# EAGLE design meca_2014 (EAGLE 6.5.0)
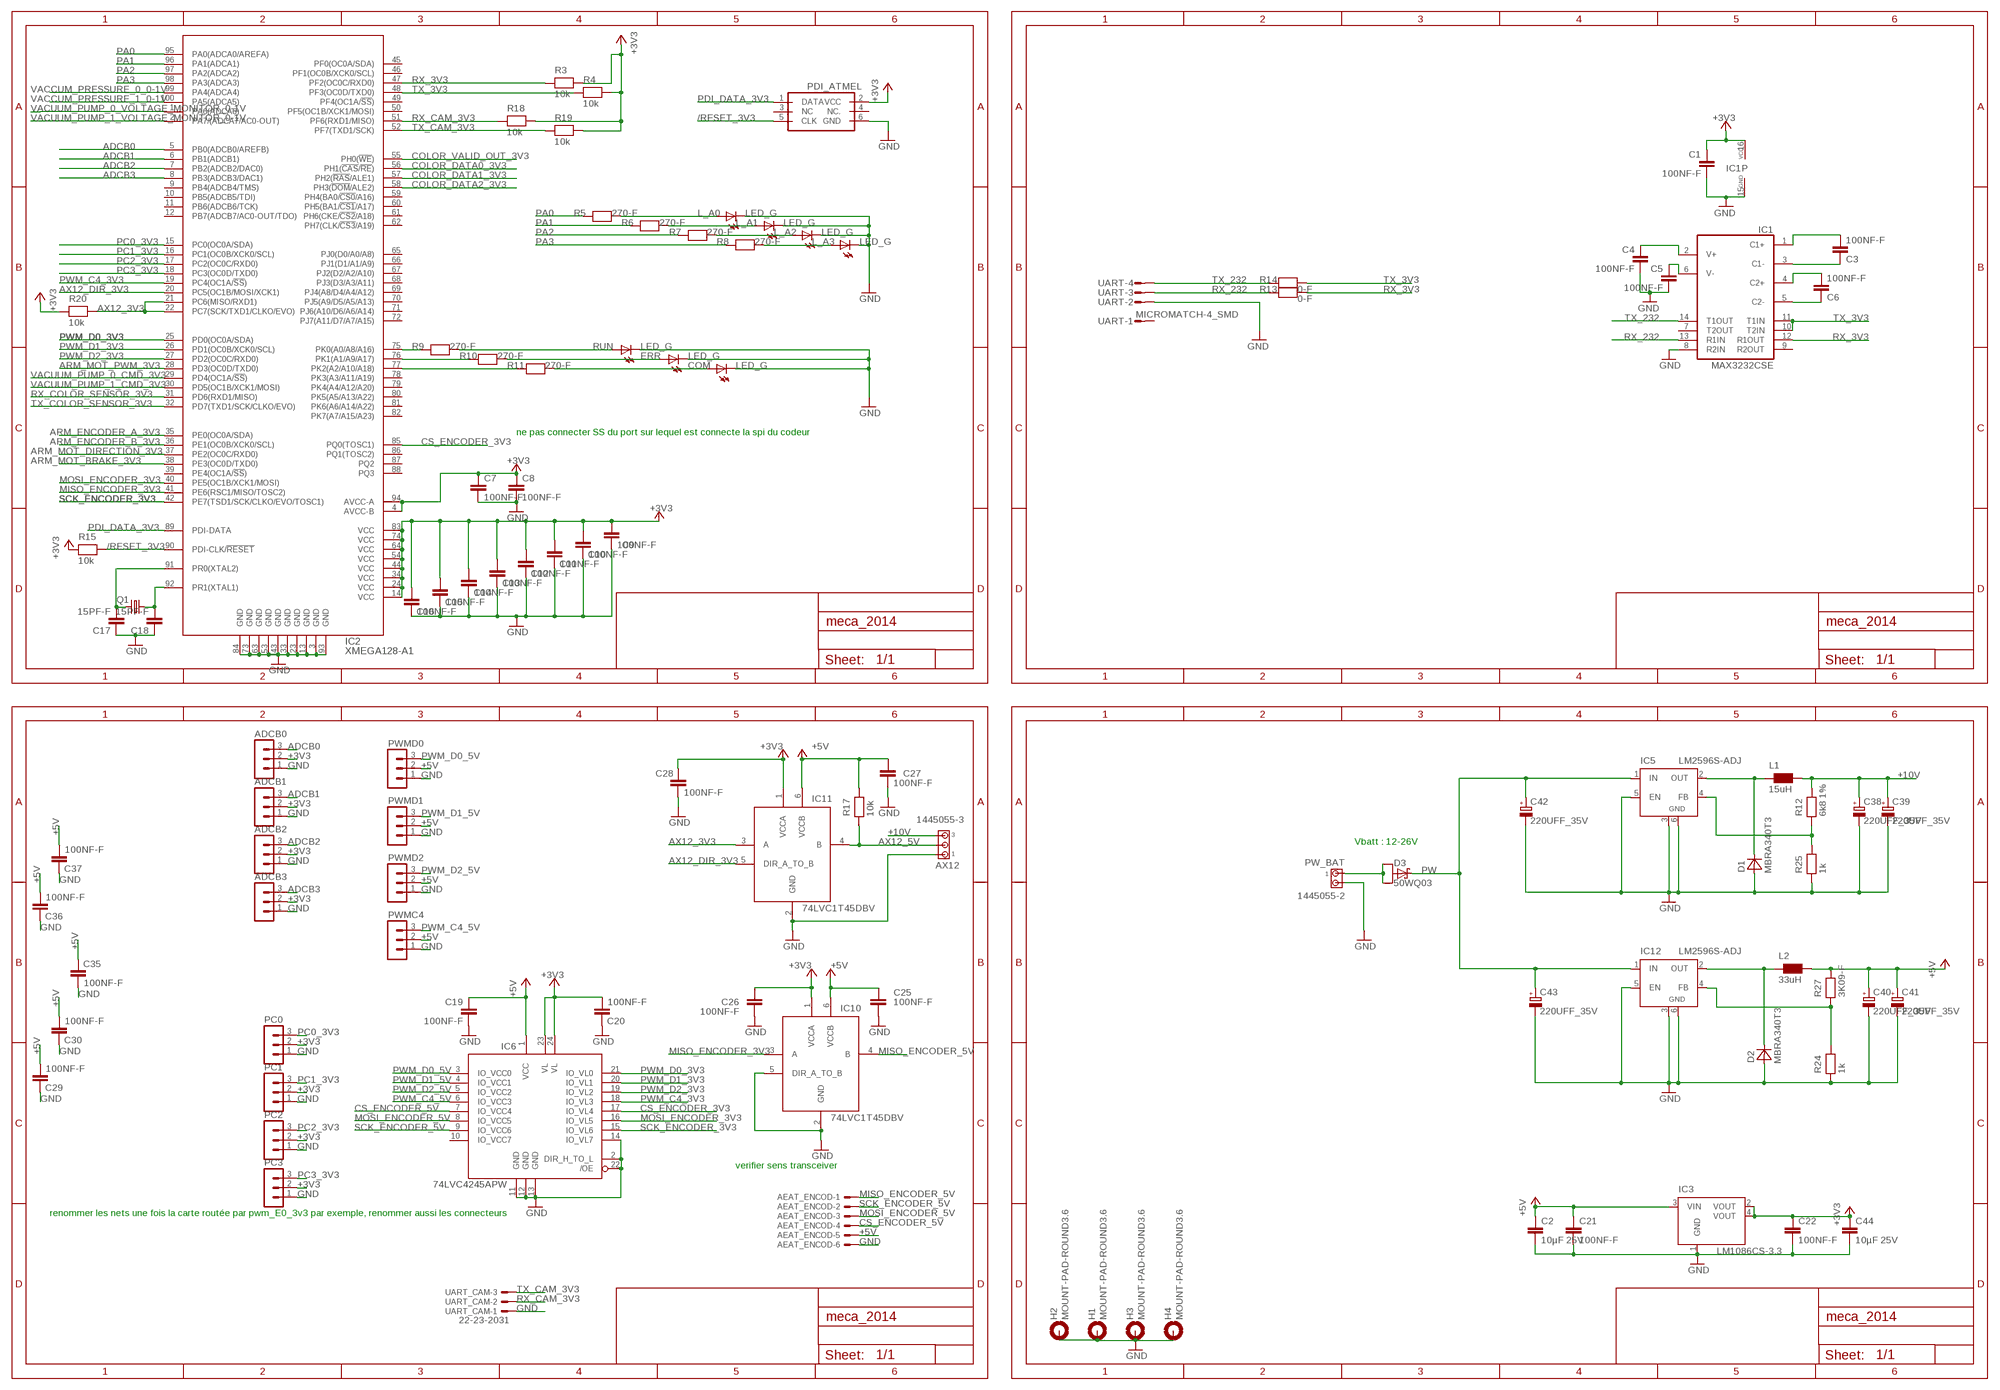
[diagram p0: schematic, sheet 1, part 1 of 2]
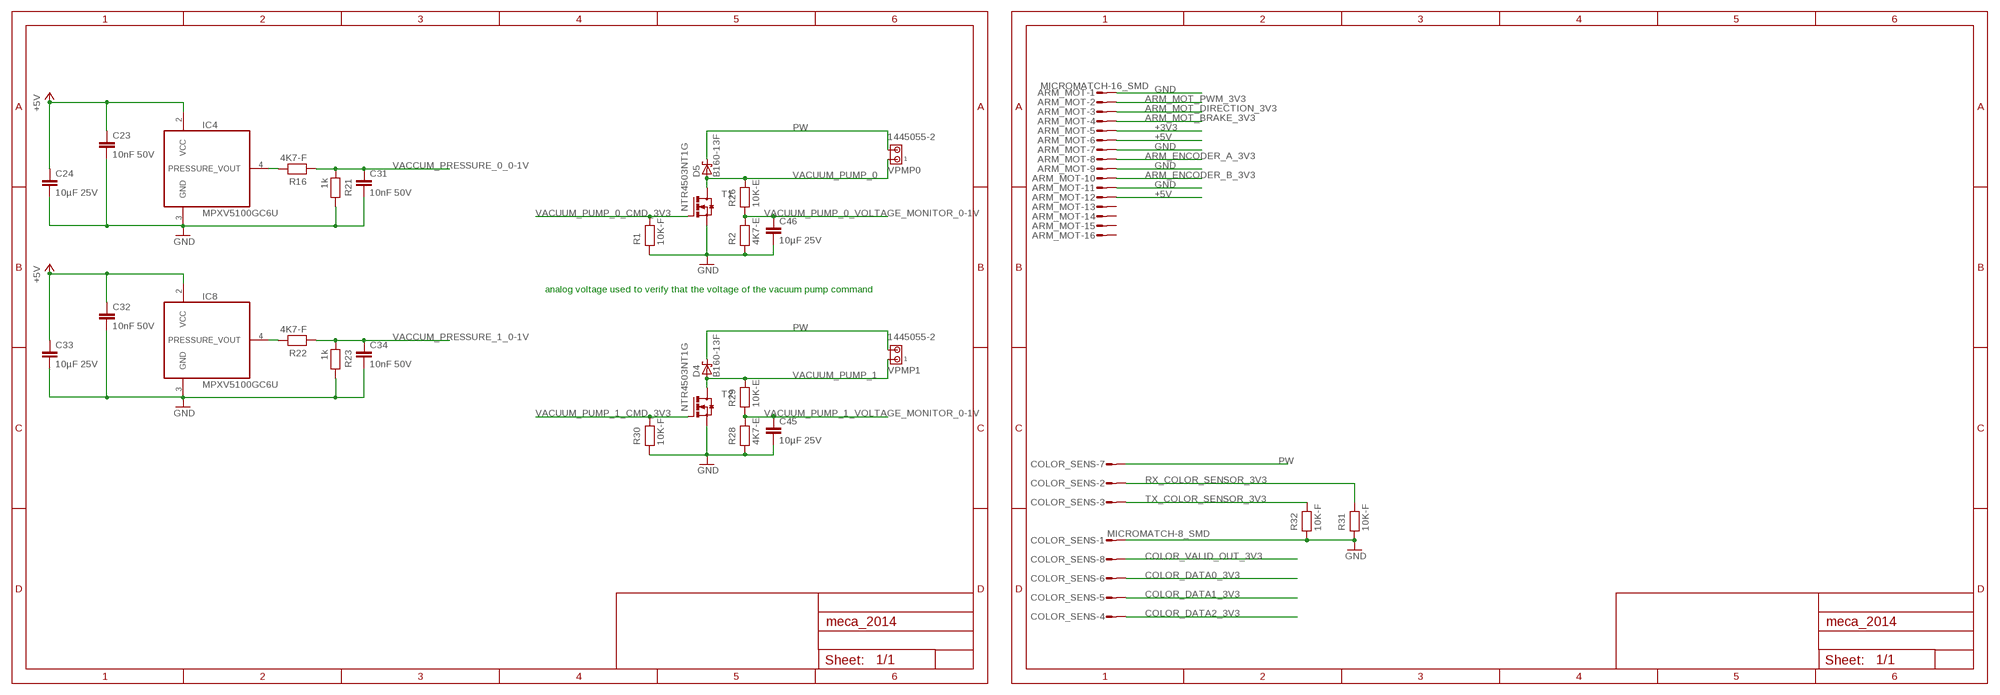
[diagram p1: schematic, sheet 1, part 2 of 2]

## Parts
ADCB0  MA03-1  [MA03-1]
ADCB1  MA03-1  [MA03-1]
ADCB2  MA03-1  [MA03-1]
ADCB3  MA03-1  [MA03-1]
AEAT_ENCOD  22-23-2061  [22-23-2061]
ARM_MOT  MICROMATCH-16_SMD  [MICROMATCH-16_SMD]
AX12  1445055-3  [1445055-3]
C1  100NF-F  [C0603]
C2  10µF 25V  10UF-C_25V  [C1210]
C3  100NF-F  [C0603]
C4  100NF-F  [C0603]
C5  100NF-F  [C0603]
C6  100NF-F  [C0603]
C7  100NF-F  [C0603]
C8  100NF-F  [C0603]
C9  100NF-F  [C0603]
C10  100NF-F  [C0603]
C11  100NF-F  [C0603]
C12  100NF-F  [C0603]
C13  100NF-F  [C0603]
C14  100NF-F  [C0603]
C15  100NF-F  [C0603]
C16  100NF-F  [C0603]
C17  15PF-F  [C0603]
C18  15PF-F  [C0603]
C19  100NF-F  [C0603]
C20  100NF-F  [C0603]
C21  100NF-F  [C0603]
C22  100NF-F  [C0603]
C23  10nF 50V  10NF-F  [C0603]
C24  10µF 25V  10UF-C_25V  [C1210]
C25  100NF-F  [C0603]
C26  100NF-F  [C0603]
C27  100NF-F  [C0603]
C28  100NF-F  [C0603]
C29  100NF-F  [C0603]
C30  100NF-F  [C0603]
C31  10nF 50V  10NF-F  [C0603]
C32  10nF 50V  10NF-F  [C0603]
C33  10µF 25V  10UF-C_25V  [C1210]
C34  10nF 50V  10NF-F  [C0603]
C35  100NF-F  [C0603]
C36  100NF-F  [C0603]
C37  100NF-F  [C0603]
C38  220UFF_35V  [PANASONIC_F]
C39  220UFF_35V  [PANASONIC_F]
C40  220UFF_35V  [PANASONIC_F]
C41  220UFF_35V  [PANASONIC_F]
C42  220UFF_35V  [PANASONIC_F]
C43  220UFF_35V  [PANASONIC_F]
C44  10µF 25V  10UF-C_25V  [C1210]
C45  10µF 25V  10UF-C_25V  [C1210]
C46  10µF 25V  10UF-C_25V  [C1210]
COLOR_SENS  MICROMATCH-8_SMD  [MICROMATCH-8_SMD]
COM  LED_G  [CHIP-LED0805]
D1  MBRA340T3  [SMA]
D2  MBRA340T3  [SMA]
D3  50WQ03  [TO252]
D4  B160-13F  [SMA]
D5  B160-13F  [SMA]
ERR  LED_G  [CHIP-LED0805]
H1  MOUNT-PAD-ROUND3.6  [3,6-PAD]
H2  MOUNT-PAD-ROUND3.6  [3,6-PAD]
H3  MOUNT-PAD-ROUND3.6  [3,6-PAD]
H4  MOUNT-PAD-ROUND3.6  [3,6-PAD]
IC1  MAX3232CSE  [SO16]
IC2  XMEGA128-A1  XMEGA-A1TQFP  [TQFP100]
IC3  LM1086CS-3.3  [TO263]
IC4  MPXV5100GC6U  [482A]
IC5  LM2596S-ADJ  [TO263-5]
IC6  74LVC4245APW  [TSSOP24]
IC8  MPXV5100GC6U  [482A]
IC10  74LVC1T45DBV  [SOT23-6]
IC11  74LVC1T45DBV  [SOT23-6]
IC12  LM2596S-ADJ  [TO263-5]
L1  15uH  SRR1280-150  [SRR1280]
L2  33uH  33µH-3.3A  [SRR1280]
L_A0  LED_G  [CHIP-LED0805]
L_A1  LED_G  [CHIP-LED0805]
L_A2  LED_G  [CHIP-LED0805]
L_A3  LED_G  [CHIP-LED0805]
PC0  MA03-1  [MA03-1]
PC1  MA03-1  [MA03-1]
PC2  MA03-1  [MA03-1]
PC3  MA03-1  [MA03-1]
PDI_ATMEL  PDI_ATMELL  [ML6L]
PW_BAT  1445055-2  [1445055-2]
PWMC4  MA03-1  [MA03-1]
PWMD0  MA03-1  [MA03-1]
PWMD1  MA03-1  [MA03-1]
PWMD2  MA03-1  [MA03-1]
Q1  CRYSTAL_16MHZ_HC49UP  [HC49UP]
R1  10K-F  [R0603]
R2  4K7-E  [R0805]
R3  10k  10K-F  [R0603]
R4  10k  10K-F  [R0603]
R5  270-F  [R0603]
R6  270-F  [R0603]
R7  270-F  [R0603]
R8  270-F  [R0603]
R9  270-F  [R0603]
R10  270-F  [R0603]
R11  270-F  [R0603]
R12  6k8 1%  6K8-F  [R0603]
R13  0-F  [R0603]
R14  0-F  [R0603]
R15  10k  10K-F  [R0603]
R16  4K7-F  [R0603]
R17  10k  10K-F  [R0603]
R18  10k  10K-F  [R0603]
R19  10k  10K-F  [R0603]
R20  10k  10K-F  [R0603]
R21  1k  1K-F  [R0603]
R22  4K7-F  [R0603]
R23  1k  1K-F  [R0603]
R24  1k  1K-F  [R0603]
R25  1k  1K-F  [R0603]
R26  10K-E  [R0805]
R27  3K09-F  [R0603]
R28  4K7-E  [R0805]
R29  10K-E  [R0805]
R30  10K-F  [R0603]
R31  10K-F  [R0603]
R32  10K-F  [R0603]
RUN  LED_G  [CHIP-LED0805]
T1  NTR4503NT1G  [SOT23]
T2  NTR4503NT1G  [SOT23]
UART  MICROMATCH-4_SMD  [MICROMATCH-4_SMD]
UART_CAM  22-23-2031  [22-23-2031]
VPMP0  1445055-2  [1445055-2]
VPMP1  1445055-2  [1445055-2]

## Nets
+3V3: ADCB0.2 ADCB1.2 ADCB2.2 ADCB3.2 ARM_MOT.5 C1.1 C7.1 C8.1 C9.1 C10.1 C11.1 C12.1 C13.1 C14.1 C15.1 C16.1 C20.1 C22.1 C26.1 C28.1 C44.1 IC1.16(VCC) IC2.4(AVCC-B) IC2.14(VCC) IC2.24(VCC) IC2.34(VCC) IC2.44(VCC) IC2.54(VCC) IC2.64(VCC) IC2.74(VCC) IC2.83(VCC) IC2.94(AVCC-A) IC3.2(VOUT) IC3.4(VOUT) IC6.23(VL) IC6.24(VL) IC10.1(VCCA) IC11.1(VCCA) PC0.2 PC1.2 PC2.2 PC3.2 PDI_ATMEL.2(VCC) R3.2 R4.2 R15.1 R18.2 R19.2 R20.1
+5V: AEAT_ENCOD.5 ARM_MOT.6 ARM_MOT.12 C2.1 C19.1 C21.1 C23.1 C24.1 C25.1 C27.1 C29.1 C30.1 C32.1 C33.1 C35.1 C36.1 C37.1 C40.+ C41.+ IC3.3(VIN) IC4.2(VCC) IC6.1(VCC) IC8.2(VCC) IC10.6(VCCB) IC11.6(VCCB) L2.2 PWMC4.2 PWMD0.2 PWMD1.2 PWMD2.2 R17.2 R27.2
+10V: AX12.3 C38.+ C39.+ L1.2 R12.2
/RESET_3V3: IC2.90(PDI-CLK/!RESET) PDI_ATMEL.5(CLK) R15.2
ADCB0: ADCB0.3 IC2.5(PB0(ADCB0/AREFB))
ADCB1: ADCB1.3 IC2.6(PB1(ADCB1))
ADCB2: ADCB2.3 IC2.7(PB2(ADCB2/DAC0))
ADCB3: ADCB3.3 IC2.8(PB3(ADCB3/DAC1))
ARM_ENCODER_A_3V3: ARM_MOT.8 IC2.35(PE0(OC0A/SDA))
ARM_ENCODER_B_3V3: ARM_MOT.10 IC2.36(PE1(OC0B/XCK0/SCL))
ARM_MOT_BRAKE_3V3: ARM_MOT.4 IC2.38(PE3(OC0D/TXD0))
ARM_MOT_DIRECTION_3V3: ARM_MOT.3 IC2.37(PE2(OC0C/RXD0))
ARM_MOT_PWM_3V3: ARM_MOT.2 IC2.28(PD3(OC0D/TXD0))
AX12_3V3: IC2.21(PC6(MISO/RXD1)) IC2.22(PC7(SCK/TXD1/CLKO/EVO)) IC11.3(A) R20.2
AX12_5V: AX12.2 IC11.4(B) R17.1
AX12_DIR_3V3: IC2.20(PC5(OC1B/MOSI/XCK1)) IC11.5(DIR_A_TO_B)
COLOR_DATA0_3V3: COLOR_SENS.6 IC2.56(PH1(!CAS!/!RE!))
COLOR_DATA1_3V3: COLOR_SENS.5 IC2.57(PH2(!RAS!/ALE1))
COLOR_DATA2_3V3: COLOR_SENS.4 IC2.58(PH3(!DOM!/ALE2))
COLOR_VALID_OUT_3V3: COLOR_SENS.8 IC2.55(PH0(!WE!))
CS_ENCODER_3V3: IC2.85(PQ0(TOSC1)) IC6.17(IO_VL4)
CS_ENCODER_5V: AEAT_ENCOD.4 IC6.7(IO_VCC4)
GND: ADCB0.1 ADCB1.1 ADCB2.1 ADCB3.1 AEAT_ENCOD.6 ARM_MOT.1 ARM_MOT.7 ARM_MOT.9 ARM_MOT.11 AX12.1 C1.2 C2.2 C4.2 C5.2 C7.2 C8.2 C9.2 C10.2 C11.2 C12.2 C13.2 C14.2 C15.2 C16.2 C17.1 C18.1 C19.2 C20.2 C21.2 C22.2 C23.2 C24.2 C25.2 C26.2 C27.2 C28.2 C29.2 C30.2 C31.2 C32.2 C33.2 C34.2 C35.2 C36.2 C37.2 C38.- C39.- C40.- C41.- C42.- C43.- C44.2 C45.2 C46.2 COLOR_SENS.1 COM.C D1.A D2.A ERR.C H1.B3,6(MOUNT) H2.B3,6(MOUNT) H3.B3,6(MOUNT) H4.B3,6(MOUNT) IC1.8(R2IN) IC1.15(GND) IC2.3(GND) IC2.13(GND) IC2.23(GND) IC2.33(GND) IC2.43(GND) IC2.53(GND) IC2.63(GND) IC2.73(GND) IC2.84(GND) IC2.93(GND) IC3.1(GND) IC4.3(GND) IC5.3(GND) IC5.5(EN) IC5.6(GND) IC6.2(DIR_H_TO_L) IC6.11(GND) IC6.12(GND) IC6.13(GND) IC6.14(IO_VL7) IC6.22(/OE) IC8.3(GND) IC10.2(GND) IC10.5(DIR_A_TO_B) IC11.2(GND) IC12.3(GND) IC12.5(EN) IC12.6(GND) L_A0.C L_A1.C L_A2.C L_A3.C PC0.1 PC1.1 PC2.1 PC3.1 PDI_ATMEL.6(GND) PW_BAT.2 PWMC4.1 PWMD0.1 PWMD1.1 PWMD2.1 R1.1 R2.1 R21.2 R23.2 R24.1 R25.1 R28.1 R30.1 R31.1 R32.1 RUN.C T1.2(S) T2.2(S) UART.2 UART_CAM.1
MISO_ENCODER_3V3: IC2.41(PE6(RSC1/MISO/TOSC2)) IC10.3(A)
MISO_ENCODER_5V: AEAT_ENCOD.1 IC10.4(B)
MOSI_ENCODER_3V3: IC2.40(PE5(OC1B/XCK1/MOSI)) IC6.16(IO_VL5)
MOSI_ENCODER_5V: AEAT_ENCOD.3 IC6.8(IO_VCC5)
N$1: C3.1 IC1.1(C1+)
N$2: R9.2 RUN.A
N$3: IC12.4(FB) R24.2 R27.1
N$4: ERR.A R10.2
N$5: C3.2 IC1.3(C1-)
N$6: C6.1 IC1.4(C2+)
N$7: COM.A R11.2
N$8: IC5.4(FB) R12.1 R25.2
N$9: IC2.75(PK0(A0/A8/A16)) R9.1
N$10: IC2.76(PK1(A1/A9/A17)) R10.1
N$11: C4.1 IC1.2(V+)
N$12: IC2.77(PK2(A2/A10/A18)) R11.1
N$13: C5.1 IC1.6(V-)
N$14: D3.1(A1) D3.3(A2) PW_BAT.1
N$15: IC4.4(PRESSURE_VOUT) R16.2
N$16: D1.C IC5.2(OUT) L1.1
N$17: D2.C IC12.2(OUT) L2.1
N$19: IC8.4(PRESSURE_VOUT) R22.2
N$24: C6.2 IC1.5(C2-)
N$45: C17.2 IC2.91(PR0(XTAL2)) Q1.2
N$46: C18.2 IC2.92(PR1(XTAL1)) Q1.1
N$91: L_A0.A R5.2
N$92: L_A1.A R6.2
N$93: L_A2.A R7.2
N$94: L_A3.A R8.2
PA0: IC2.95(PA0(ADCA0/AREFA)) R5.1
PA1: IC2.96(PA1(ADCA1)) R6.1
PA2: IC2.97(PA2(ADCA2)) R7.1
PA3: IC2.98(PA3(ADCA3)) R8.1
PC0_3V3: IC2.15(PC0(OC0A/SDA)) PC0.3
PC1_3V3: IC2.16(PC1(OC0B/XCK0/SCL)) PC1.3
PC2_3V3: IC2.17(PC2(OC0C/RXD0)) PC2.3
PC3_3V3: IC2.18(PC3(OC0D/TXD0)) PC3.3
PDI_DATA_3V3: IC2.89(PDI-DATA) PDI_ATMEL.1(DATA)
PW: C42.+ C43.+ COLOR_SENS.7 D3.4(C) D4.A(C) D5.A(C) IC5.1(IN) IC12.1(IN) VPMP0.2 VPMP1.2
PWM_C4_3V3: IC2.19(PC4(OC1A/!SS!)) IC6.18(IO_VL3)
PWM_C4_5V: IC6.6(IO_VCC3) PWMC4.3
PWM_D0_3V3: IC2.25(PD0(OC0A/SDA)) IC6.21(IO_VL0)
PWM_D0_5V: IC6.3(IO_VCC0) PWMD0.3
PWM_D1_3V3: IC2.26(PD1(OC0B/XCK0/SCL)) IC6.20(IO_VL1)
PWM_D1_5V: IC6.4(IO_VCC1) PWMD1.3
PWM_D2_3V3: IC2.27(PD2(OC0C/RXD0)) IC6.19(IO_VL2)
PWM_D2_5V: IC6.5(IO_VCC2) PWMD2.3
RX_3V3: IC1.12(R1OUT) IC2.47(PF2(OC0C/RXD0)) R3.1 R13.2
RX_232: IC1.13(R1IN) R13.1 UART.3
RX_CAM_3V3: IC2.51(PF6(RXD1/MISO)) R18.1 UART_CAM.2
RX_COLOR_SENSOR_3V3: COLOR_SENS.2 IC2.31(PD6(RXD1/MISO)) R31.2
SCK_ENCODER_3V3: IC2.42(PE7(TSD1/SCK/CLKO/EVO/TOSC1)) IC6.15(IO_VL6)
SCK_ENCODER_5V: AEAT_ENCOD.2 IC6.9(IO_VCC6)
TX_3V3: IC1.10(T2IN) IC1.11(T1IN) IC2.48(PF3(OC0D/TXD0)) R4.1 R14.2
TX_232: IC1.14(T1OUT) R14.1 UART.4
TX_CAM_3V3: IC2.52(PF7(TXD1/SCK)) R19.1 UART_CAM.3
TX_COLOR_SENSOR_3V3: COLOR_SENS.3 IC2.32(PD7(TXD1/SCK/CLKO/EVO)) R32.2
VACCUM_PRESSURE_0_0-1V: C31.1 IC2.99(PA4(ADCA4)) R16.1 R21.1
VACCUM_PRESSURE_1_0-1V: C34.1 IC2.100(PA5(ADCA5)) R22.1 R23.1
VACUUM_PUMP_0: D5.C(A) R26.2 T1.3(D) VPMP0.1
VACUUM_PUMP_0_CMD_3V3: IC2.29(PD4(OC1A/!SS!)) R1.2 T1.1(G)
VACUUM_PUMP_0_VOLTAGE_MONITOR_0-1V: C46.1 IC2.1(PA6(ADCA6)) R2.2 R26.1
VACUUM_PUMP_1: D4.C(A) R29.2 T2.3(D) VPMP1.1
VACUUM_PUMP_1_CMD_3V3: IC2.30(PD5(OC1B/XCK1/MOSI)) R30.2 T2.1(G)
VACUUM_PUMP_1_VOLTAGE_MONITOR_0-1V: C45.1 IC2.2(PA7/(ADCA7/AC0-OUT)) R28.2 R29.1
Unconnected: ARM_MOT.13 ARM_MOT.14 ARM_MOT.15 ARM_MOT.16 IC1.7(T2OUT) IC1.9(R2OUT) IC2.9(PB4(ADCB4/TMS)) IC2.10(PB5(ADCB5/TDI)) IC2.11(PB6(ADCB6/TCK)) IC2.12(PB7(ADCB7/AC0-OUT/TDO)) IC2.39(PE4(OC1A/!SS!)) IC2.45(PF0(OC0A/SDA)) IC2.46(PF1(OC0B/XCK0/SCL)) IC2.49(PF4(OC1A/!SS!)) IC2.50(PF5(OC1B/XCK1/MOSI)) IC2.59(PH4(BA0/!CS0!/A16)) IC2.60(PH5(BA1/!CS1!/A17)) IC2.61(PH6(CKE/!CS2!/A18)) IC2.62(PH7(CLK/!CS3!/A19)) IC2.65(PJ0(D0/A0/A8)) IC2.66(PJ1(D1/A1/A9)) IC2.67(PJ2(D2/A2/A10)) IC2.68(PJ3(D3/A3/A11)) IC2.69(PJ4(A8/D4/A4/A12)) IC2.70(PJ5(A9/D5/A5/A13)) IC2.71(PJ6(A10/D6/A6/A14)) IC2.72(PJ7(A11/D7/A7/A15)) IC2.78(PK3(A3/A11/A19)) IC2.79(PK4(A4/A12/A20)) IC2.80(PK5(A5/A13/A22)) IC2.81(PK6(A6/A14/A22)) IC2.82(PK7(A7/A15/A23)) IC2.86(PQ1(TOSC2)) IC2.87(PQ2) IC2.88(PQ3) IC6.10(IO_VCC7) PDI_ATMEL.3(NC) PDI_ATMEL.4(NC.) UART.1

## Notes on the sheet
- ne pas connecter SS du port sur lequel est connecte la spi du codeur
- Vbatt : 12-26V
- verifier sens transceiver
- renommer les nets une fois la carte routée par pwm_E0_3v3 par exemple, renommer aussi les connecteurs
- analog voltage used to verify that the voltage of the vacuum pump command

## Library data of the parts
ADCB0 ADCB1-ADCB3 PC0 PC1-PC3 PWMC4 PWMD0 PWMD1 PWMD2 = con-lstb:MA03-1: PIN HEADER; OC_FARNELL: unknown; OC_NEWARK: unknown
AEAT_ENCOD = robotter_connector:22-23-2061: .100" (2.54mm) Center Header - 6 Pin; FARNELL: 1462922; MF: MOLEX; MOUSER: 538-22-23-2061; MPN: 22-23-2061; RS: 679-5593
ARM_MOT = robotter_connector:MICROMATCH-16_SMD: MicroMaTch 16 FN : 1565592 / 8-215464-6 / 1-215464-6 Drawing Number C-215464 DDEController.pdf; MOUSER: 571-8-188275-6; RS: 739-1237
AX12 = robotter_connector:1445055-3: Micro MATE-N-LOK Connectors grid 1.5 mm Source: ENG_CD_1445055_A.pdf; FARNELL: 1111119; MOUSER: 571-2-1445055-3; RS: 495-9596
C1 C3-C16 C19-C22 C25-C30 C35-C37 = robotter_capacitor:100NF; MOUSER: 81-GRM188F51H104ZA01; RS: 723-5534; VALUE: 100nF 50V
C2 C24 C33 C44-C46 = robotter_capacitor:10UF; MOUSER: 963-TMK316BJ106KL-T; RS: 766-1185
C17 C18 = robotter_capacitor:15PF; MOUSER: 581-06031A150K4T2A; RS: 147-421; VALUE: 15pF_0603_100V
C23 C31 C32 C34 = robotter_capacitor:10NF; MOUSER: 81-GCM188R71H103KA7D; RS: 723-4982
C38-C43 = robotter_capacitor:220UF; MOUSER: 667-EEE-FP1V221AP; RS: 568-828; VALUE: 220µF 35V
COLOR_SENS = robotter_connector:MICROMATCH-8_SMD: Ref FN : 1865096; FARNELL: 1865096; MOUSER: 571-7-188275-8; RS: 739-1227
COM ERR L_A0 L_A1-L_A3 RUN = robotter_diode:LED_; MOUSER: 859-LTST-C171GKT; RS: 692-0935; VALUE: GREEN
D1 D2 = robotter_diode:MBRA340T3: Surface Mount Schottky Power Rectifier Source: http://www.onsemi.com/pub_link/Collateral/MBRA340T3-D.PDF; MOUSER: 863-MBRA340T3G; RS: 688-0502
D3 = robotter_diode:50WQ03; MOUSER: 844-50WQ03FNPBF; RS: 302-167
D4 D5 = robotter_diode:B160-13F; MOUSER: 621-B160-F; RS: 738-4765
H1-H4 = holes:MOUNT-PAD-ROUND: MOUNTING PAD, round
IC1 = robotter_ic:MAX3232: True RS-232 Transceivers 3.0V to 5.5V, Low-Power up to 1Mbps, Using Four 0.1µF External Capacitors Source: http://pdfserv.maxim-ic.com/en/ds/MAX3222-MAX3241.pdf; MOUSER: 511-ST3232CDR; RS: 415-2105
IC2 = avr-7:XMEGA-A1: Atmel XMega A1 Series processor
IC3 = robotter_ic:LM1086CS-3.3; MOUSER: 926-LM1086CS-3.3NOPB; RS: 533-9426
IC4 IC8 = robotter_ic:MPXV5100GC6U; FN: 1608911; MOUSER: 841-MPXV5100GC6U
IC5 IC12 = robotter_ic:LM2596S: STEP-DOWN VOLTAGE REGULATOR; FARNELL: 1469194; MOUSER: 926-LM2596SX-ADJNOPB; RS: 533-3715
IC6 = robotter_ic:74LVC4245: octal transceiver buffer; MOUSER: 771-74LVC4245APW-T; RS: 380-0500
IC10 IC11 = robotter_ic:74LVC1T45; MOUSER: 595-SN74LVC1T45DBVT; RS: 662-8825
L1 = robotter_inductor:SRR1280; MOUSER: 652-SRR1280-150M; RS: 693-4643; VALUE: 15µH 5.2A
L2 = robotter_inductor:33µH; MOUSER: 652-SRR1280-330M; RS: 727-2274; VALUE: 33µH
PDI_ATMEL = robotter_connector:PDI_ATMEL: Ref Harting : 09 18 506 7323 Atmel pdi connector; MOUSER: 617-09-18-506-7323; RS: 693-5242
PW_BAT VPMP0 VPMP1 = robotter_connector:1445055-2: Micro MATE-N-LOK Connectors grid 1.5 mm Source: ENG_CD_1445055_A.pdf; MOUSER: 571-2-1445055-2; RS: 495-9580
Q1 = robotter_ic:CRYSTAL_: CRYSTAL; MOUSER: 559-FOXSD160-20-LF; RS: 547-6531; VALUE: 16 MHz
R1 R3 R4 R15 R17-R20 R30-R32 = robotter_resistor:10K; MOUSER: 652-CR0603-JW-103ELF; RS: 740-8899
R2 R28 = robotter_resistor:4K7; MOUSER: 279-CRG0805F4K7; RS: 223-0528
R5-R11 = robotter_resistor:270; MOUSER: 71-CRCW0603J-270-E3; RS: 679-0071
R12 = robotter_resistor:6K8; MOUSER: 652-CR0603-JW-682GLF; RS: 740-8969; VALUE: 6k8
R13 R14 = robotter_resistor:0
R16 R22 = robotter_resistor:4K7; MOUSER: 652-CR0603-JW-472GLF; RS: 740-8959
R21 R23-R25 = robotter_resistor:1K; MOUSER: 71-CRCW0603-1.0K-E3; RS: 213-2266
R26 R29 = robotter_resistor:10K; MOUSER: 71-CRCW080510K0FKEB; RS: 740-9072
R27 = robotter_resistor:3K09; MOUSER: 667-ERA-3AEB3091V; RS: 708-7574
T1 T2 = robotter_ic:NTR4503NT1G; MOUSER: 863-NTR4503NT1G; RS: 780-4751
UART = robotter_connector:MICROMATCH-4_SMD: Ref FN : 1865094; MOUSER: 571-7-188275-4; RS: 366-1721
UART_CAM = robotter_connector:22-23-2031: .100" (2.54mm) Center Header - 3 Pin; FARNELL: 1462950; MF: MOLEX; MOUSER: 538-22-23-2031; MPN: 22-23-2031; RS: 679-5587

## Board
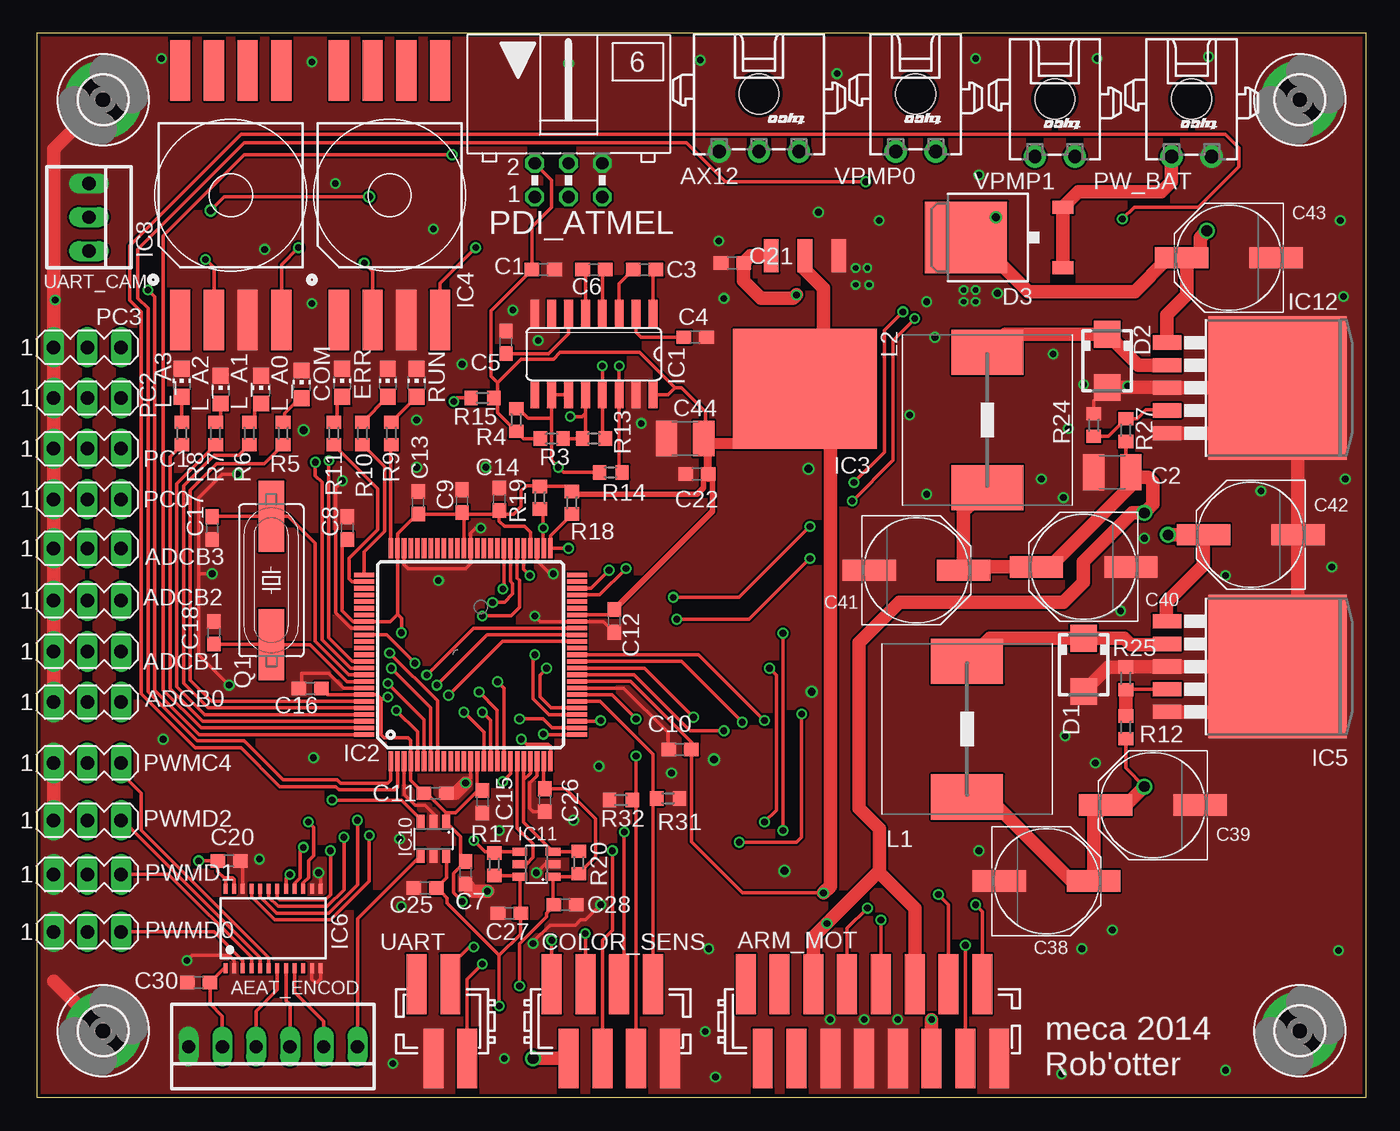
[diagram p2: board, top side]
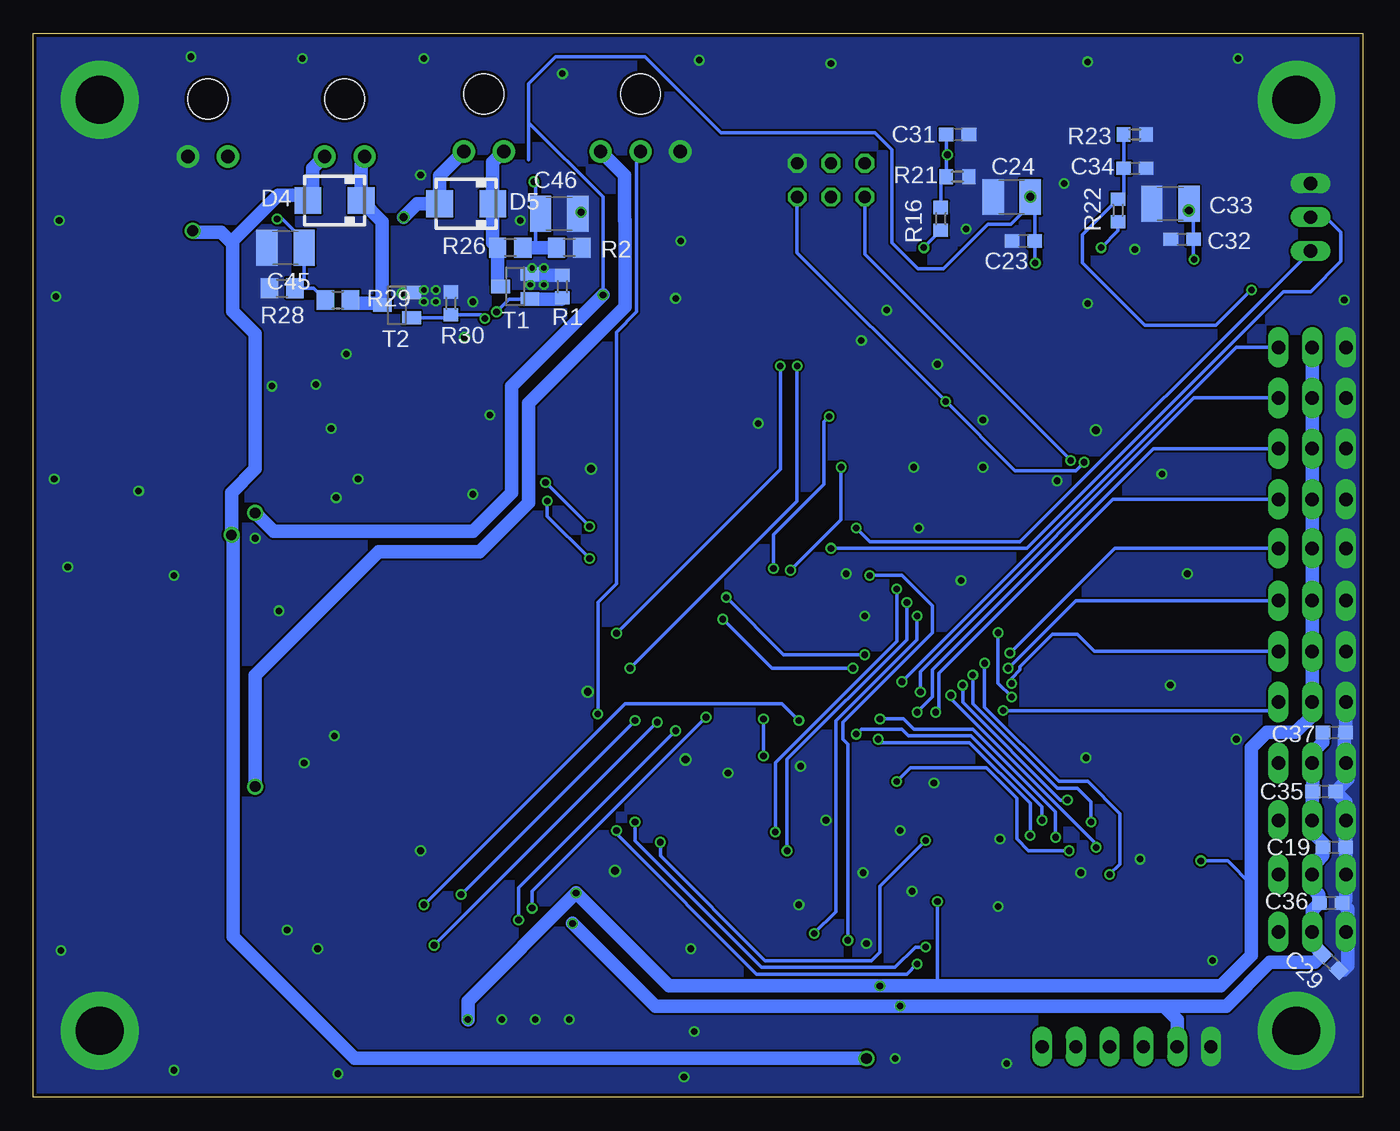
[diagram p3: board, bottom side, seen from below]

Size 100 x 80 mm. Coordinates in mm from the lower left corner, seen from the top.
Outline: 0,0 100,0 100,80 0,80 0,0
Copper layers (1*16): Top 0.035mm / dielectric 1.5mm / Bottom 0.035mm
Design rules "default": minimum track width 6mil, minimum drill 12mil, track to track 6mil, track to pad 6mil, pad to pad 6mil, via to via 6mil, smd to smd 0mil, copper to edge 10mil, drill to drill 10mil, minimum pad ring 10mil, minimum via ring 6mil, stop-mask expansion 2mil, vias tented up to drill 100mil, thermal gap 10mil

### Footprints (pad centres in the part's own frame; a part is rotated, then mirrored left to right if it is on the bottom)
MA03-1 = drill 1.016 long: 1 -2.54,0; 2 0,0; 3 2.54,0
22-23-2061 = drill 1 long: 1 -6.35,0; 2 -3.81,0; 3 -1.27,0; 4 1.27,0; 5 3.81,0; 6 6.35,0
MICROMATCH-16_SMD = smd 1.5 x 4.5: 1 9.525,-2.794; 2 8.255,2.794; 3 6.985,-2.794; 4 5.715,2.794; 5 4.445,-2.794; 6 3.175,2.794; 7 1.905,-2.794; 8 0.635,2.794; 9 -0.635,-2.794; 10 -1.905,2.794; 11 -3.175,-2.794; 12 -4.445,2.794; 13 -5.715,-2.794; 14 -6.985,2.794; 15 -8.255,-2.794; 16 -9.525,2.794
1445055-3 = drill 1 pad 1.676: 1 3,4.32; 2 0,4.32; 3 -3,4.32 | hole 3: 0,0
C0603 = smd 1.1 x 1: 1 -0.85,0; 2 0.85,0
C1210 = smd 1.6 x 2.7: 1 -1.4,0; 2 1.4,0
PANASONIC_F = smd 4 x 1.6: + 3.55,0; - -3.55,0
MICROMATCH-8_SMD = smd 1.5 x 4.5: 1 4.445,-2.794; 2 3.175,2.794; 3 1.905,-2.794; 4 0.635,2.794; 5 -0.635,-2.794; 6 -1.905,2.794; 7 -3.175,-2.794; 8 -4.445,2.794
CHIP-LED0805 = smd 1.2 x 1.2: A 0,-1.05; C 0,1.05
SMA = smd 2 x 2: A 2,0; C -2,0
TO252 = smd 1 x 1.6: 1 -2.28,-4.8; 3 2.28,-4.8 | smd 5.4 x 6.2: 4 0,2.5
3,6-PAD = drill 3.6 pad 5.842: B3,6 0,0
SO16 = smd 0.66 x 2.032: 1 -4.445,-3.073; 2 -3.175,-3.073; 3 -1.905,-3.073; 4 -0.635,-3.073; 5 0.635,-3.073; 6 1.905,-3.073; 7 3.175,-3.073; 8 4.445,-3.073; 9 4.445,3.073; 10 3.175,3.073; 11 1.905,3.073; 12 0.635,3.073; 13 -0.635,3.073; 14 -1.905,3.073; 15 -3.175,3.073; 16 -4.445,3.073
TQFP100 = smd 1.5 x 0.347: 1 -8,6; 2 -8,5.5; 3 -8,5; 4 -8,4.5; 5 -8,4; 6 -8,3.5; 7 -8,3; 8 -8,2.5; 9 -8,2; 10 -8,1.5; 11 -8,1; 12 -8,0.5; 13 -8,0; 14 -8,-0.5; 15 -8,-1; 16 -8,-1.5; 17 -8,-2; 18 -8,-2.5; 19 -8,-3; 20 -8,-3.5; 21 -8,-4; 22 -8,-4.5; 23 -8,-5; 24 -8,-5.5; 25 -8,-6; 51 8,-6; 52 8,-5.5; 53 8,-5; 54 8,-4.5; 55 8,-4; 56 8,-3.5; 57 8,-3; 58 8,-2.5; 59 8,-2; 60 8,-1.5; 61 8,-1; 62 8,-0.5; 63 8,0; 64 8,0.5; 65 8,1; 66 8,1.5; 67 8,2; 68 8,2.5; 69 8,3; 70 8,3.5; 71 8,4; 72 8,4.5; 73 8,5; 74 8,5.5; 75 8,6 | smd 0.347 x 1.5: 26 -6,-8; 27 -5.5,-8; 28 -5,-8; 29 -4.5,-8; 30 -4,-8; 31 -3.5,-8; 32 -3,-8; 33 -2.5,-8; 34 -2,-8; 35 -1.5,-8; 36 -1,-8; 37 -0.5,-8; 38 0,-8; 39 0.5,-8; 40 1,-8; 41 1.5,-8; 42 2,-8; 43 2.5,-8; 44 3,-8; 45 3.5,-8; 46 4,-8; 47 4.5,-8; 48 5,-8; 49 5.5,-8; 50 6,-8; 76 6,8; 77 5.5,8; 78 5,8; 79 4.5,8; 80 4,8; 81 3.5,8; 82 3,8; 83 2.5,8; 84 2,8; 85 1.5,8; 86 1,8; 87 0.5,8; 88 0,8; 89 -0.5,8; 90 -1,8; 91 -1.5,8; 92 -2,8; 93 -2.5,8; 94 -3,8; 95 -3.5,8; 96 -4,8; 97 -4.5,8; 98 -5,8; 99 -5.5,8; 100 -6,8
TO263 = smd 1.1 x 2.5: 1 -2.54,-8.15; 2 0,-8.15; 3 2.54,-8.15 | smd 10.8 x 9: 4 0,1.85
482A = smd 1.524 x 4.54: 1 -3.81,-9.382; 2 -1.27,-9.382; 3 1.27,-9.382; 4 3.81,-9.382; 5 3.81,9.382; 6 1.27,9.382; 7 -1.27,9.382; 8 -3.81,9.382
TO263-5 = smd 1.067 x 2.159: 1 -3.404,-5.791; 2 -1.702,-5.791; 3 0,-5.791; 4 1.702,-5.791; 5 3.404,-5.791 | smd 10.8 x 10.41: 6 0,2.54
TSSOP24 = smd 0.3 x 0.75: 1 -3.575,-3; 2 -2.925,-3; 3 -2.275,-3; 4 -1.625,-3; 5 -0.975,-3; 6 -0.325,-3; 7 0.325,-3; 8 0.975,-3; 9 1.625,-3; 10 2.275,-3; 11 2.925,-3; 12 3.575,-3; 13 3.575,3; 14 2.925,3; 15 2.275,3; 16 1.625,3; 17 0.975,3; 18 0.325,3; 19 -0.325,3; 20 -0.975,3; 21 -1.625,3; 22 -2.275,3; 23 -2.925,3; 24 -3.575,3
SOT23-6 = smd 0.6 x 1.1: 1 -0.95,-1.25; 2 0,-1.25; 3 0.95,-1.25; 4 0.95,1.25; 5 0,1.25; 6 -0.95,1.25
SRR1280 = smd 3.4 x 5.4: 1 -5.1,0; 2 5.1,0
ML6L = drill 0.914 octagon: 1 -2.54,-1.27; 2 -2.54,1.27; 3 0,-1.27; 4 0,1.27; 5 2.54,-1.27; 6 2.54,1.27
1445055-2 = drill 1 pad 1.676: 1 1.5,4.32; 2 -1.5,4.32 | hole 3: 0,0
HC49UP = smd 5.334 x 1.93: 1 -4.826,0; 2 4.826,0
R0603 = smd 1 x 1.1: 1 -0.85,0; 2 0.85,0
R0805 = smd 1.3 x 1.5: 1 -0.95,0; 2 0.95,0
SOT23 = smd 1 x 1.4: 1 -0.95,-1.1; 2 0.95,-1.1; 3 0,1.1
MICROMATCH-4_SMD = smd 1.5 x 4.5: 1 1.905,-2.794; 2 0.635,2.794; 3 -0.635,-2.794; 4 -1.905,2.794
22-23-2031 = drill 1 long: 1 -2.54,0; 2 0,0; 3 2.54,0

### Placement (x,y rotation side)
ADCB0  3.81,29.72 0 top
ADCB1  3.81,33.53 0 top
ADCB2  3.81,37.34 0 top
ADCB3  3.81,41.27 0 top
AEAT_ENCOD  17.78,3.81 180 top
ARM_MOT  62.87,5.71 0 top
AX12  54.33,75.44 180 top
C1  38.1,62.23 0 top
C2  80.9,46.99 180 top
C3  45.72,62.23 180 top
C4  49.53,57.15 0 top
C5  35.31,56.77 90 top
C6  41.91,62.23 180 top
C7  32.26,16.89 270 top
C8  23.37,42.8 90 top
C9  32,44.83 90 top
C10  48.39,26.16 180 top
C11  29.97,22.86 0 top
C12  43.43,35.81 270 top
C13  28.7,44.7 90 top
C14  34.8,44.96 90 top
C15  33.53,22.23 270 top
C16  20.57,30.73 180 top
C17  13.21,42.8 90 top
C18  13.34,34.92 270 top
C19  2.16,18.8 0 bottom
C20  14.48,17.78 0 top
C21  52.32,62.74 180 top
C22  49.66,46.86 180 top
C23  25.53,64.39 180 bottom
C24  26.42,67.69 180 bottom
C25  29.21,15.75 180 top
C26  38.23,22.35 270 top
C27  35.56,13.84 180 top
C28  39.75,14.48 0 top
C29  2.41,10.16 315 bottom
C30  12.19,8.64 180 top
C31  30.48,72.39 0 bottom
C32  13.59,64.52 180 bottom
C33  14.48,67.18 180 bottom
C34  17.14,69.85 0 bottom
C35  2.92,22.99 0 bottom
C36  2.41,14.61 0 bottom
C37  2.16,27.43 0 bottom
C38  75.95,16.26 0 top
C39  83.95,21.97 180 top
C40  78.74,39.88 180 top
C41  66.17,39.62 0 top
C42  91.31,42.29 180 top
C43  89.66,63.12 180 top
C44  48.77,49.53 180 top
C45  81.03,63.88 180 bottom
C46  60.45,66.42 0 bottom
COLOR_SENS  43.18,5.71 0 top
COM  22.99,53.72 0 top
D1  78.74,32.51 270 top
D2  80.52,55.37 270 top
D3  72.39,64.64 90 top
D4  77.34,67.44 180 bottom
D5  67.44,67.18 180 bottom
ERR  26.42,53.72 0 top
H1  95,75 0 top
H2  95,5 0 top
H3  5,75 0 top
H4  5,5 0 top
IC1  41.91,55.88 180 top
IC2  32.64,33.27 90 top
IC3  57.78,55.12 180 top
IC4  26.54,67.82 0 top
IC5  90.81,32.38 270 top
IC6  17.78,12.7 0 top
IC8  14.61,67.82 0 top
IC10  29.84,19.43 180 top
IC11  37.59,17.53 90 top
IC12  90.81,53.34 270 top
L1  69.98,27.69 270 top
L2  71.5,50.93 270 top
L_A0  19.94,53.59 0 top
L_A1  16.89,53.21 0 top
L_A2  13.84,53.21 0 top
L_A3  10.92,53.72 0 top
PC0  3.81,44.96 0 top
PC1  3.81,48.77 0 top
PC2  3.81,52.58 0 top
PC3  3.81,56.39 0 top
PDI_ATMEL  40.01,68.96 0 top
PW_BAT  86.87,75.06 180 top
PWMC4  3.81,25.15 0 top
PWMD0  3.81,12.45 0 top
PWMD1  3.81,16.76 0 top
PWMD2  3.81,20.83 0 top
Q1  17.65,38.86 90 top
R1  60.2,60.96 270 bottom
R2  59.69,63.88 180 bottom
R3  38.73,49.53 180 top
R4  36.07,50.93 270 top
R5  18.54,49.91 90 top
R6  16,49.91 90 top
R7  13.46,49.91 90 top
R8  10.92,49.91 90 top
R9  26.67,49.91 90 top
R10  24.51,49.91 90 top
R11  22.35,49.91 90 top
R12  81.92,27.81 270 top
R13  41.91,49.53 180 top
R14  43.18,46.99 180 top
R15  33.53,52.58 180 top
R16  31.75,66.04 270 bottom
R17  34.42,17.53 270 top
R18  40.26,44.7 90 top
R19  37.85,45.09 90 top
R20  40.77,17.65 90 top
R21  30.48,69.22 0 bottom
R22  18.41,66.67 270 bottom
R23  17.14,72.39 0 bottom
R24  79.5,50.55 270 top
R25  81.92,31.5 270 top
R26  64.14,63.88 180 bottom
R27  81.92,50.16 270 top
R28  81.28,60.83 0 bottom
R29  77.09,59.94 0 bottom
R30  68.58,59.69 270 bottom
R31  47.5,22.48 180 top
R32  43.94,22.35 0 top
RUN  28.57,53.72 0 top
T1  63.75,60.96 90 bottom
T2  72.64,59.56 90 bottom
UART  30.48,5.71 180 top
UART_CAM  3.94,66.17 270 top
VPMP0  66.11,75.44 180 top
VPMP1  76.58,75.06 180 top

### Tracks (layer width: path | path; a pad name or v marks a point on that pad's centre or on a via)
+3V3  (via drill 0.5)
  Top 0.254: 58.58,52.28 59.03,52.73 58.38,53.38 58.29,53.38 | R3.2 36.62,49.53 R4.2 34.67,51.47 34.67,52.45 | 34.67,53.72 34.67,52.45 | 48.01,53.34 45.34,56.01 39.37,56.01 38.86,55.5 36.45,55.5 34.67,53.72 | v12.19,17.78 C20.1 13.63,16.98 14.1,16.51 | 14.1,16.51 14.21,16.4 IC6.24 | IC6.23 14.86,16.39 14.73,16.51 14.1,16.51 | v36.32,8.38 36.32,11.56 38.35,13.59 38.35,13.84 38.65,14.14 38.9,14.14 C28.1 38.84,14.54 IC11.1 40.54,16.58 R20.1 42.04,18.07 42.04,20.95 39.79,23.2 C26.1 38.14,23.29 IC2.24 | IC2.14 33.14,23.46 C15.1 33.19,23.07 31.52,21.4 30.8,21.4 | IC2.94 25.61,30.27 25.91,29.97 | 25.91,29.97 25.91,27.27 26.12,27.05 27.94,27.05 28.14,26.85 IC2.4 28.14,23.84 C11.1 29.34,22.86 30.8,21.4 | IC2.94 25.57,30.27 | 25.91,29.97 26.29,29.97 v26.42,30.1 | 32.13,41.28 IC2.64 32.14,43.85 | IC1.16 47.47,52.81 48.01,53.34 | 27.14,36.33 26.58,35.77 IC2.83 23.79,35.77 22.99,36.58 22.99,41.82 23.11,41.95 C8.1 | v27.43,34.92 27.43,36.04 27.14,36.33 | 27.14,36.33 IC2.74 27.14,42.38 28.61,43.85 C13.1 32.14,43.85 | IC2.34 44.67,31.27 49.24,26.71 C10.1 49.24,19.22 53.09,15.37 v59.18,15.37 | IC2.44 43.04,36.27 C12.1 | IC2.94 21.88,30.27 C16.1 | v32,14.73 31.37,15.37 31.37,16.85 C7.1 31.88,18.12 31.88,19.6 IC10.1 30.8,21.4 | 37.43,45.94 R19.2 39.88,45.94 R18.2 | IC2.54 37.14,42.49 36.7,42.93 35.18,42.93 34.8,43.31 C14.1 | 34.54,43.85 C14.1 | 32.14,43.85 C9.1 32.13,43.85 34.92,43.85 | 37.72,45.97 36.83,45.97 36.45,45.59 36.45,44.45 35.85,43.85 34.92,43.85 | C14.1 34.8,43.98 34.92,43.85 | R15.1 34.51,52.45 34.67,52.45 | 34.67,53.72 34.16,54.23 34.16,59.14 C1.1 37.25,65.44 38.73,66.93 38.73,68.96 PDI_ATMEL.2
  Top 0.254: 48.01,53.34 48.51,53.34 50.29,51.56 50.29,49.65 C44.1
  Top 0.406: R18.2 40.47,45.34 49.66,45.34 50.16,45.85 50.16,46.52 C22.1 50.84,46.53 50.84,44.07 C12.1
  Top 0.61: 50.51,46.57 C22.1 50.51,49.19 C44.1
  Top 0.813: 50.51,49.19 53.89,49.19 54.74,50.04 56.33,50.04 58.58,52.28
  Top 1.016: IC3.2 57.78,62.23 59.18,60.83 59.18,55.37 57.78,53.98 IC3.4 57.9,53.38 58.29,53.38 58.17,53.51 | v59.18,15.37 59.69,15.88 59.69,52.07 58.38,53.38 | ARM_MOT.5 v67.31,5.84
  Bottom 0.254: v12.19,17.78 10.16,17.78 8.38,16 | v26.42,30.1 27.43,31.11 v27.43,34.92 | v32,14.73 32,8.38
  Bottom 1.016: v67.31,5.84 67.31,7.24 v59.18,15.37 52.2,8.38 v36.32,8.38 32,8.38 10.67,8.38 8.38,10.67 8.38,16 8.38,26.29 7.24,27.43 5.08,27.43 3.81,28.7 ADCB0.2 ADCB1.2 ADCB2.2 ADCB3.2 PC0.2 PC1.2 PC2.2 PC3.2
+5V  (via drill 0.5, 0.6, 0.8)
  Top 0.254: AEAT_ENCOD.5 13.97,6.1 13.04,7.02 C30.1 14.11,9.7 IC6.1 | R17.2 36.24,16.68 IC11.6 36.34,13.91 C27.1 36.41,12.28 34.8,10.67 | IC10.6 30.82,18.15 30.82,16.51 C25.1 30.06,15.41 30.44,15.41 30.86,14.99 30.86,14.61 34.8,10.67 | 34.8,10.67 v34.8,6.86 | R27.2 81.92,47.37 C2.1 | IC4.2 25.27,62.1 v24.64,62.74 | IC8.2 13.34,62.36 v12.7,62.99 | C24.1 14.1,67.69 v13.08,66.67
  Top 1.016: ARM_MOT.12 58.42,12.06 v59.44,13.08 63.25,16.89 63.37,16.89 | 57.02,60.2 v57.15,60.33 56.9,60.07 54.48,60.07 53.17,61.38 C21.1 53.7,63.27 IC3.3 | L2.2 69.72,44.04 C41.+ 69.97,39.88 C40.+ 76.2,39.88 82.3,45.98 C2.1 82.68,46.61 83.57,46.61 83.95,46.23 83.95,44.58 v83.31,43.94 82.42,43.94 78.74,40.26 78.74,38.73 77.22,37.21 64.9,37.21 61.85,34.16 61.85,21.72 63.37,20.19 63.37,16.89 | 63.37,16.89 66.04,14.22 ARM_MOT.6
  Bottom 0.254: v57.15,60.33 57.15,67.69 62.74,73.28 | 62.74,73.28 62.74,76.2 60.71,78.23 53.98,78.23 48.26,72.52 36.7,72.52 35.43,71.25 35.43,64.26 33.47,62.29 31.56,62.29 28.19,65.66 26.45,65.66 25.57,66.55 25.57,67.14 25.4,67.31 | 62.74,73.28 62.74,70.48 | v12.7,62.99 12.74,63.03 C32.1 12.74,66.33 v13.08,66.67 12.91,66.84 12.74,66.84 C33.1 | 25.4,67.31 C24.1 | v24.64,62.74 24.68,62.78 C23.1 24.68,66.59 25.4,67.31
  Bottom 1.016: v59.44,13.08 53.21,6.86 v34.8,6.86 14.99,6.86 | 14.99,6.86 10.29,6.86 6.99,10.16 3.62,10.16 C29.1 3.81,11.56 PWMD0.2 3.81,14.06 C36.1 3.3,14.64 3.3,15.24 3.81,15.75 PWMD1.2 3.56,17.02 3.56,17.65 3.01,18.2 C19.1 3.01,19.14 3.68,19.81 3.68,20.7 PWMD2.2 3.81,22.95 C35.1 3.77,25.11 PWMC4.2 3.81,25.91 3.01,26.71 C37.1 | AEAT_ENCOD.5 13.97,5.84 14.99,6.86 | v83.31,43.94 81.92,42.55 66.93,42.55 64.01,45.47 64.01,53.47 v57.15,60.33
  other vias: 25.02,67.69
+10V  (via drill 0.8)
  Top 0.254: R12.2 81.92,24.77 v83.31,23.37
  Top 1.016: 83.31,23.24 v83.31,23.37 81.92,21.97 C39.+ 79.5,21.07 C38.+ | 79.11,16.64 C38.+ | C38.+ 77.85,16.26 71.52,22.59 L1.2
  Bottom 1.016: v83.31,23.37 83.31,31.75 74.04,41.02 66.42,41.02 62.74,44.7 62.74,52.2 55.5,59.44 55.5,65.96 55.55,65.96 55.55,69.33 AX12.3
/RESET_3V3  (via drill 0.5)
  Top 0.254: IC2.90 23.61,32.27 21.46,34.42 21.46,46.23 20.95,46.74 v20.95,47.75 | v31.37,52.32 31.62,52.58 R15.2
  Bottom 0.254: v20.95,47.75 21.59,47.12 26.16,47.12 v31.37,52.32 42.55,63.5 PDI_ATMEL.5
ADCB0  (via drill 0.5)
  Top 0.254: v27.05,29.08 28.64,27.5 IC2.5
  Bottom 0.254: ADCB0.3 6.99,29.08 v27.05,29.08
ADCB1  (via drill 0.5)
  Top 0.254: IC2.6 29.14,28.39 v26.42,31.11
  Bottom 0.254: v26.42,31.11 26.42,31.5 25.78,32.13 25.78,32.38 23.37,34.8 21.46,34.8 20.19,33.53 ADCB1.3
ADCB2  (via drill 0.5)
  Top 0.254: IC2.7 29.64,29.29 v26.67,32.26
  Bottom 0.254: ADCB2.3 21.59,37.34 v26.67,32.26
ADCB3  (via drill 0.5)
  Top 0.254: IC2.8 30.14,29.8 v26.54,33.4
  Bottom 0.254: v26.54,33.4 18.67,41.27 ADCB3.3
ARM_ENCODER_A_3V3  (via drill 0.5)
  Top 0.254: ARM_MOT.8 v63.5,13.34 | IC2.35 44.93,31.77 49.15,27.56 v51.69,27.56
  Bottom 0.254: v63.5,13.34 63.5,15.75 v51.69,27.56
ARM_ENCODER_B_3V3  (via drill 0.5)
  Top 0.254: ARM_MOT.10 60.96,12.7 v62.48,14.22 | v49.4,28.57 45.7,32.27 IC2.36
  Bottom 0.254: v62.48,14.22 62.48,15.49 v49.4,28.57
ARM_MOT_BRAKE_3V3  (via drill 0.5)
  Top 0.254: IC2.38 49.78,33.27 v54.74,28.32 | v67.82,15.24 68.58,14.48 ARM_MOT.4
  Bottom 0.254: v54.74,28.32 v67.82,15.24
ARM_MOT_DIRECTION_3V3  (via drill 0.5)
  Top 0.254: ARM_MOT.3 v69.85,11.43 | v53.08,28.2 48.51,32.77 IC2.37
  Bottom 0.254: v69.85,11.43 v53.08,28.2
ARM_MOT_PWM_3V3  (via drill 0.5)
  Top 0.254: IC2.28 42.37,28.27 v42.42,28.32 | v70.61,14.48 71.12,13.97 ARM_MOT.2
  Bottom 0.254: v42.42,28.32 43.69,29.59 55.5,29.59 v70.61,14.48
AX12_3V3
  Top 0.254: R20.2 40.74,18.48 IC11.3 36.64,20.68 36.64,23.88 | IC2.21 36.64,23.88 | IC2.22 37.14,24.38 36.64,23.88
AX12_5V  (via drill 0.5)
  Top 0.254: R17.1 34.52,18.48 | 34.52,18.48 33.72,18.48 v32.89,19.3 | v52.83,19.18 57.15,19.18 57.53,19.56 v57.53,28.83 | 34.52,18.48 IC11.4
  Bottom 0.254: v32.89,19.3 36.32,15.88 36.32,10.92 36.96,10.29 44.96,10.29 52.83,18.16 v52.83,19.18 | v57.53,28.83 57.53,37.21 56.13,38.61 56.13,57.53 54.61,59.05 54.61,70.84 AX12.2
AX12_DIR_3V3
  Top 0.254: IC2.20 36.14,20.25 37.34,19.05 37.34,18.03 36.83,17.53 IC11.5
COLOR_DATA0_3V3  (via drill 0.5)
  Top 0.254: IC2.56 36.14,39.05 36.32,38.86 36.32,36.83 35.69,36.2 v33.53,36.2 | COLOR_SENS.6 v41.27,12.32
  Bottom 0.254: v41.27,12.32 39.62,13.97 39.62,28.32 33.53,34.42 v33.53,36.2
COLOR_DATA1_3V3  (via drill 0.5)
  Top 0.254: COLOR_SENS.5 42.55,11.81 43.31,12.57 v43.31,18.54 | IC2.57 35.64,38.78 35.81,38.61 35.81,37.85 35.18,37.21 v34.29,37.21
  Bottom 0.254: v43.31,18.54 43.31,25.4 34.29,34.42 v34.29,37.21
COLOR_DATA2_3V3  (via drill 0.5)
  Top 0.254: v35.05,38.23 35.14,38.31 IC2.58 | COLOR_SENS.4 44.2,8.89 v44.2,19.94
  Bottom 0.254: v35.05,38.23 35.05,34.29 44.2,25.15 v44.2,19.94
COLOR_VALID_OUT_3V3  (via drill 0.5)
  Top 0.254: COLOR_SENS.8 v38.73,11.81 | v37.08,39.24 36.64,39.69 IC2.55
  Bottom 0.254: v38.73,11.81 38.73,26.54 39.12,26.92 39.12,28.19 32.38,34.92 32.38,36.96 34.67,39.24 v37.08,39.24
CS_ENCODER_3V3  (via drill 0.5)
  Top 0.254: IC2.85 26.31,34.77 v28.45,32.64 | IC6.17 18.75,16.47 v19.05,16.76
  Bottom 0.254: v28.45,32.64 28.45,29.34 22.86,23.75 20.7,23.75 18.29,21.34 18.29,17.53 v19.05,16.76
CS_ENCODER_5V
  Top 0.254: IC6.7 18.11,8.07 16.51,6.48 AEAT_ENCOD.4
GND  (via drill 0.4, 0.5, 0.6)
  Top 0.254: 15.49,17.61 C20.2 15.51,17.6 IC6.22 | IC6.12 21.36,8.91 21.08,8.64 20.95,8.64 20.7,8.89 IC6.11 | IC6.2 14.86,10.29 14.48,10.67 11.68,10.67 v11.3,10.29 | IC2.13 32.64,24 v32.26,23.62 | v37.59,16.89 38.23,17.53 IC11.2 | 33.02,42.8 32.64,42.42 IC2.63 32.64,40.13 32.26,39.75 27.94,39.75 27.64,40.05 IC2.73 | IC2.53 37.64,40.34 38.61,39.37 v38.86,39.37 | v21.21,16.89 21.36,16.75 IC6.13 | IC2.23 37.64,24.18 37.08,23.62 37.08,21.72 37.34,21.46 38.19,21.46 C26.2 | IC2.84 23.65,35.27 22.48,36.45 22.48,45.85 v22.99,46.35 | C12.2 42.62,35.77 IC2.43 37.89,35.77 v37.47,36.2 | IC2.33 44.16,30.77 47.5,27.43 47.5,26.2 C10.2 | v37.34,11.56 37.34,11.68 38.61,12.95 40.51,12.95 40.89,13.34 41.27,13.34 v42.42,14.48 | IC2.3 27.64,22.78 28.45,21.97 29.21,21.97 29.84,21.34 IC10.2 29.84,21.08 | v14.48,30.99 12.19,33.27 12.19,39.37 | 12.19,39.37 12.19,45.09 13.97,46.86 v15.11,46.86 | v13.21,39.37 12.19,39.37 | IC2.93 23.07,30.77 21.97,31.88 19.94,31.88 19.94,30.95 C16.2 | 79.63,52.48 D2.A | R24.1 79.5,52.36 D2.A | D2.A 81.95,53.37 v82.04,53.47
  Top 1.016: 90.04,53.34 IC12.3 84.98,53.37 D2.A | 90.04,53.34 IC12.6 94.86,51.82 C42.- 94.86,33.9 IC5.6 90.68,32.38 | IC12.5 85.04,49.91 90.17,49.91 90.04,50.04 90.04,53.34 | 90.68,32.38 IC5.3 81.45,32.38 81.41,32.35 | 90.68,32.38 90.68,28.96 85.04,28.96 IC5.5 85,29 | 93.8,5 H2.B3,6 | 4.95,7.87 4.95,4.95 | PWMC4.1 PWMD2.1 | 1.27,8.73 H4.B3,6 | ADCB0.1 ADCB1.1 ADCB2.1 ADCB3.1 PC0.1 PC1.1 PC2.1 PC3.1 1.27,71.27 H3.B3,6 | C7.2 32.8,15.49 v33.91,15.49 | C11.2 31.5,22.86 v32.26,23.62 | D1.A 80.57,32.35 81.41,32.35 | 81.41,32.35 R25.1
  Bottom 1.016: R1.1 62.55,61.81 T1.2 | C37.2 1.27,27.47 ADCB0.1 | 1.4,27.18 1.4,25.27 PWMC4.1 1.27,24.51 1.14,24.38 1.14,23.91 C35.2 | PWMD2.1 1.27,22.23 2.03,22.99 | C19.2 1.31,20.79 PWMD2.1 | C36.2 1.14,14.19 1.14,9.91 1.49,9.56 C29.2 | PWMD2.1 PWMD1.1 1.27,14.86 1.52,14.61
  other vias: 77.22,45.09 16.76,17.91 9.53,26.92 59.69,5.84 62.23,5.84 64.77,5.84 42.29,24.89 47.75,24.38 40.39,20.83 34.8,20.07 33.4,42.8 45.47,50.67 51.69,60.07 30.23,38.86 37.72,56.9 27.3,19.43 27.43,14.35 28.57,50.93 33.78,47.37 28.57,47.37 35.81,59.18 32,55.12 20.7,59.69 17.14,63.75 29.84,65.28 1.4,59.94 26.8,2.54 35.18,2.92 51.05,1.52 50.29,4.95 50.55,11.18 77.09,1.78 89.41,2.03 70.87,18.54 80.9,12.57 97.92,11.05 78.61,11.18 79.63,25.15 97.41,39.88 89.41,39.24 98.04,65.91 88.14,78.23 70.61,78.11 49.91,77.98 60.2,76.96 40.01,77.72 20.7,77.85 9.4,78.11 22.48,68.71 66.93,45.34 20.83,25.53 98.3,60.2 98.42,46.48 67.56,57.15 72.26,60.45 83.31,42.04 76.45,55.88 77.6,50.29 78.74,53.59 75.56,46.48 92.08,45.59 65.66,51.31 81.53,36.58 77.34,27.18 58.8,66.55 51.31,64.39 63.37,65.91 66.93,59.82 70.87,69.34 79.76,78.11 58.04,47.24 50.93,25.4 20.07,50.16 58.29,30.48 56.26,17.02 62.61,61.09 62.48,62.36 61.59,62.36 61.59,61.09 70.61,60.71 69.72,60.71 70.61,59.82 69.72,59.82
  pour Top (no thermals): -3.56,80.77 103.25,80.77 103.5,-1.4 -3.56,-1.4
  pour Bottom (no thermals): -5.33,80.77 101.47,80.77 101.47,-1.4 -5.33,-1.4
MISO_ENCODER_3V3  (via drill 0.5)
  Top 0.254: IC2.41 33.88,34.77 v30.1,30.99 | IC10.3 28.89,20.89 27.43,22.35 v22.23,22.35
  Bottom 0.254: v30.1,30.99 30.1,29.72 22.73,22.35 v22.23,22.35
MISO_ENCODER_5V
  Top 0.254: AEAT_ENCOD.1 24.13,13.42 IC10.4
MOSI_ENCODER_3V3  (via drill 0.5)
  Top 0.254: IC2.40 35.04,34.27 v30.99,30.23 | IC6.16 19.41,15.98 19.43,16 19.43,16.13 19.81,16.51 19.81,18.54 v20.07,18.8
  Bottom 0.254: v20.07,18.8 20.07,19.05 30.99,29.97 v30.99,30.23
MOSI_ENCODER_5V
  Top 0.254: IC6.8 18.75,7.28 19.05,6.99 AEAT_ENCOD.3
N$1
  Top 0.254: C3.1 46.35,62.02 IC1.1
N$2
  Top 0.254: R9.2 RUN.A
N$3
  Top 0.254: IC12.4 84.96,51.69 83.44,51.69 82.77,51.02 R27.1 80.6,49.7 R24.2
N$4
  Top 0.254: R10.2 ERR.A
N$5
  Top 0.254: C3.2 43.81,61.17 IC1.3
N$6
  Top 0.254: C6.1 42.55,62.02 IC1.4
N$7
  Top 0.254: COM.A 22.95,52.67 22.61,52.32 22.61,51.02 R11.2
N$8
  Top 0.254: 85,30.7 81.96,30.7 R25.2
  Top 1.016: IC5.4 85,30.7 | R25.2 R12.1
N$9
  Top 0.254: IC2.75 26.64,48.58 26.67,48.62 R9.1
N$10
  Top 0.254: IC2.76 24.64,41.02 26.16,42.55 26.16,47.41 R10.1
N$11
  Top 0.254: IC1.2 45.09,57.53 45.47,57.15 C4.1
N$12
  Top 0.254: IC2.77 23.71,38.77 23.5,38.99 23.5,40.51 25.65,42.67 25.65,45.76 R11.1
N$13
  Top 0.254: IC1.6 40.01,57.4 38.52,55.92 C5.1
N$14
  Top 1.016: D3.1 77.19,66.9 | 77.19,66.9 78.36,68.07 84.58,68.07 85.34,68.83 85.34,70.71 PW_BAT.1 | 77.19,66.9 D3.3
N$15  (via drill 0.5)
  Top 0.254: v33.02,63.88 30.35,61.21 IC4.4
  Bottom 0.254: R16.2 33.02,63.92 v33.02,63.88
N$16
  Top 1.016: L1.1 71.7,34.51 D1.C 81.82,34.51 82.3,34.04 84.96,34.04 IC5.2
N$17
  Top 1.016: IC12.2 82.85,55.04 D2.C 72.85,57.37 L2.1
N$19  (via drill 0.5)
  Top 0.254: IC8.4 18.41,62.61 v19.68,63.88
  Bottom 0.254: R22.2 18.41,65.15 v19.68,63.88
N$24
  Top 0.254: C6.2 41.27,62.02 IC1.5
N$45
  Top 0.254: IC2.91 23.47,31.77 20.95,34.29 20.95,41.66 18.92,43.69 Q1.2 13.25,43.69 C17.2
N$46
  Top 0.254: IC2.92 24.61,31.24 23.37,31.24 20.57,34.04 Q1.1 17.61,34.08 C18.2
N$91
  Top 0.254: R5.2 18.67,50.89 18.67,51.44 19.78,52.54 L_A0.A
N$92
  Top 0.254: R6.2 16.38,51.14 16.38,51.69 16.86,52.16 L_A1.A
N$93
  Top 0.254: R7.2 13.84,51.14 L_A2.A
N$94
  Top 0.254: L_A3.A R8.2
PA0
  Top 0.254: IC2.95 13.15,29.77 11.56,31.37 11.56,45.63 13.55,47.62 17.11,47.62 R5.1
PA1
  Top 0.254: IC2.96 12.89,29.27 11.05,31.11 11.05,45.97 13.34,48.26 15.2,48.26 R6.1
PA2
  Top 0.254: IC2.97 12.63,28.77 10.54,30.86 10.54,46.14 R7.1
PA3
  Top 0.254: IC2.98 12.49,28.27 10.03,30.73 10.03,48.17 R8.1
PC0_3V3  (via drill 0.5)
  Top 0.254: v32.13,28.96 33.64,27.45 IC2.15
  Bottom 0.254: PC0.3 18.8,44.96 31.88,31.88 31.88,29.21 v32.13,28.96
PC1_3V3  (via drill 0.5)
  Top 0.254: v33.53,28.96 34.14,28.34 IC2.16
  Bottom 0.254: PC1.3 15.75,48.77 32.38,32.13 32.38,30.1 v33.53,28.96
PC2_3V3  (via drill 0.5)
  Top 0.254: v33.27,30.48 34.64,29.11 IC2.17
  Bottom 0.254: PC2.3 12.7,52.58 33.27,32 v33.27,30.48
PC3_3V3  (via drill 0.5)
  Top 0.254: v34.67,31.24 35.14,30.77 IC2.18
  Bottom 0.254: 6.73,56.39 PC3.3 9.53,56.39 v34.67,31.24
PDI_DATA_3V3  (via drill 0.5)
  Top 0.254: v21.97,47.88 21.97,34.54 23.74,32.77 IC2.89
  Bottom 0.254: v21.97,47.88 37.47,63.37 PDI_ATMEL.1
PW  (via drill 0.6, 0.8)
  Top 1.016: IC5.1 arc-90 84.96,35.84 84.96,37.21 87.76,40.01 C42.+ v85.09,42.29 | COLOR_SENS.7 v37.34,2.92 | 85.98,62.99 85.01,62.99 82.6,60.58 74.59,60.58 70.53,64.64 | 85.98,62.99 C43.+ 86.49,62.74 86.49,60.33 85.01,58.85 IC12.1 | 85.98,62.99 87.5,62.99 87.5,64.64 v88.01,65.15 | 70.53,64.64 D3.4 | v72.14,66.17 72.05,66.17 70.53,64.64
  Bottom 1.016: v37.34,2.92 75.82,2.92 84.96,12.06 84.96,42.16 v85.09,42.29 85.09,45.47 83.31,47.24 83.31,57.4 85.01,59.11 85.01,64.34 | 78.97,67.81 D4.A | 78.97,67.81 81.59,67.81 85.01,64.39 85.01,64.34 | 85.01,64.34 85.09,64.26 85.85,65.02 87.88,65.02 v88.01,65.15 | VPMP0.2 69.44,69.29 D5.A 71.12,67.18 v72.14,66.17 | 78.97,67.81 78.97,69.85 VPMP1.2
PWM_C4_3V3  (via drill 0.5)
  Top 0.254: IC2.19 35.64,24.34 v35.05,23.75 | IC6.18 18.11,15.04 18.29,14.86 21.72,14.86 22.1,15.24 v22.1,18.54
  Bottom 0.254: v35.05,23.75 34.04,24.77 28.32,24.77 26.04,22.48 26.04,19.43 25.15,18.54 v22.1,18.54
PWM_C4_5V
  Top 0.254: IC6.6 17.45,10.48 7.87,20.07 7.87,22.86 6.35,24.38 PWMC4.3
PWM_D0_3V3  (via drill 0.5)
  Top 0.254: IC2.25 38.64,26.39 38.48,26.54 36.83,26.54 v36.45,26.92 | IC6.21 16.16,15.09 17.91,13.34 22.1,13.34 25.02,16.26 v25.02,19.68
  Bottom 0.254: v36.45,26.92 36.2,26.67 29.59,26.67 25.02,22.1 v25.02,19.68
PWM_D0_5V
  Top 0.254: IC6.3 15.51,10.28 13.34,12.45 PWMD0.3
PWM_D1_3V3  (via drill 0.5)
  Top 0.254: IC2.26 38.13,27.27 v38.1,27.3 | IC6.20 16.8,15.07 18.03,13.84 21.97,13.84 24.13,16 v24.13,20.83
  Bottom 0.254: v38.1,27.3 37.72,27.69 34.67,27.69 34.16,27.18 29.46,27.18 24.13,21.84 v24.13,20.83
PWM_D1_5V
  Top 0.254: IC6.4 16.16,10.52 9.91,16.76 PWMD1.3
PWM_D2_3V3  (via drill 0.5)
  Top 0.254: IC2.27 38.77,27.77 38.1,28.45 v36.32,28.45 | IC6.19 17.45,15.06 18.16,14.35 21.84,14.35 23.11,15.62 v23.11,19.56
  Bottom 0.254: v36.32,28.45 34.54,28.45 33.78,27.69 29.34,27.69 23.11,21.46 v23.11,19.56
PWM_D2_5V
  Top 0.254: IC6.5 16.8,10.5 6.48,20.83 PWMD2.3
RX_3V3  (via drill 0.5)
  Top 0.254: 41.27,51.44 41.27,49.74 R13.2 R3.1 | 41.27,51.44 IC1.12 | IC2.47 42.35,37.77 v44.32,39.75 | v40.13,51.18 41.02,51.18 41.27,51.44
  Bottom 0.254: v44.32,39.75 44.32,42.29 40.51,46.1 40.51,50.8 v40.13,51.18
RX_232  (via drill 0.5)
  Top 0.254: R13.1 42.55,49.74 IC1.13 v42.55,54.99 | UART.3 31.11,9.91 32.51,11.3 v32.89,11.3 | v54.74,20.7 55.63,21.59 55.63,31.75 v55.12,32.26
  Bottom 0.254: v32.89,11.3 33.66,11.3 35.18,9.78 45.21,9.78 54.74,19.3 v54.74,20.7 | v42.55,54.99 42.55,44.83 v55.12,32.26
RX_CAM_3V3  (via drill 0.5)
  Top 0.254: R18.1 38.64,42.23 IC2.51 v40,41.27 v40.01,41.27
  Bottom 0.254: v40.01,41.27 25.27,41.27 5.97,60.58 3.94,60.58 1.65,62.87 1.65,65.02 2.79,66.17 UART_CAM.2
RX_COLOR_SENSOR_3V3
  Top 0.254: COLOR_SENS.2 46.35,22.48 | 46.35,22.48 46.35,25.78 42.36,29.77 IC2.31 | R31.2 46.35,22.48
SCK_ENCODER_3V3  (via drill 0.5)
  Top 0.254: IC2.42 32.86,35.27 v29.34,31.75 | IC6.15 20.05,16.12 20.45,16.51 20.45,17.78 20.83,18.16 20.83,20.32 v20.45,20.7
  Bottom 0.254: v29.34,31.75 29.34,29.59 22.99,23.24 21.46,23.24 20.45,22.23 v20.45,20.7
SCK_ENCODER_5V
  Top 0.254: IC6.9 19.41,7.9 21.59,5.71 AEAT_ENCOD.2
TX_3V3  (via drill 0.5)
  Top 0.254: IC1.10 IC1.11 | 38.73,53.85 IC1.10 | R14.2 39.62,46.99 v39.24,47.37 38.73,47.88 38.73,51.18 | IC1.10 38.73,51.18 | R4.1 36.23,51.78 36.96,51.05 38.61,51.05 38.73,51.18 | IC2.48 41.7,38.27 v43.05,39.62
  Bottom 0.254: v39.24,47.37 39.24,43.43 v43.05,39.62
TX_232  (via drill 0.5)
  Top 0.254: R14.1 43.81,47.2 IC1.14 v43.81,54.99 | UART.4 32.38,8.89 v33.53,10.03 | v56.13,20.07 v56.13,34.89
  Bottom 0.254: v33.53,10.03 34.29,9.27 45.59,9.27 56.13,19.81 v56.13,20.07 | v56.13,34.89 43.81,47.2 v43.81,54.99
TX_CAM_3V3  (via drill 0.5)
  Top 0.254: IC2.52 38.1,41.31 v38.1,42.8 38.1,43.98 R19.1
  Bottom 0.254: UART_CAM.3 25.78,41.78 37.08,41.78 v38.1,42.8
TX_COLOR_SENSOR_3V3  (via drill 0.5)
  Top 0.254: COLOR_SENS.3 45.09,22.61 | 45.09,22.61 v45.09,25.65 | v45.09,28.45 43.26,30.27 IC2.32 | R32.2 45.05,22.61 45.09,22.61
  Bottom 0.254: v45.09,25.65 v45.09,28.45
VACCUM_PRESSURE_0_0-1V  (via drill 0.5)
  Top 0.254: IC2.99 12.36,27.77 9.53,30.61 9.53,64.77 15.62,70.87 v31.24,70.87
  Bottom 0.254: R16.1 31.75,68.8 R21.1 31.33,70.78 v31.24,70.87 31.33,70.95 C31.1
VACCUM_PRESSURE_1_0-1V  (via drill 0.5)
  Top 0.254: IC2.100 12.22,27.27 8.89,30.61 8.89,60.2 v8.38,60.71
  Bottom 0.254: R23.1 C34.1 18,67.94 R22.1 21.08,64.86 21.08,62.74 16.38,58.04 11.05,58.04 v8.38,60.71
VACUUM_PUMP_0
  Bottom 1.016: T1.3 65.08,61.19 R26.2 65.44,64.23 D5.C 65.44,70.29 VPMP0.1
VACUUM_PUMP_0_CMD_3V3  (via drill 0.5)
  Top 0.254: IC2.29 38.54,28.77 37.34,29.97 37.34,33.15 v37.47,33.27 | v47.88,37.59 52.83,37.59 v58.17,42.93 | v61.47,46.23 63.75,48.51 63.75,57.66 v65.15,59.05
  Bottom 0.254: v37.47,33.27 43.56,33.27 v47.88,37.59 | v58.17,42.93 v61.47,46.23 | v65.15,59.05 64.2,60.01 T1.1
  Bottom 1.016: R1.2 60.3,60.01 T1.1
VACUUM_PUMP_0_VOLTAGE_MONITOR_0-1V  (via drill 0.5)
  Top 0.254: IC2.1 26.64,23.84 26.42,23.62 22.86,23.62 22.61,23.88 18.54,23.88 15.62,26.8 12.06,26.8 8.38,30.48 8.38,59.31 7.62,60.07 7.62,63.75 15.62,71.75 48.9,71.75 51.82,68.83 v62.36,68.83
  Bottom 0.254: v62.36,68.83 62.23,68.71 62.23,66.8 C46.1 62.23,66.04 62.23,64.01 62.36,63.88
  Bottom 1.016: R2.2 62.36,63.88 R26.1
VACUUM_PUMP_1
  Bottom 1.016: VPMP1.1 75.08,70.37 75.34,70.11 D4.C 73.74,65.84 T2.3 73.87,59.69 75.18,59.69 75.31,59.69 75.89,59.69 R29.2
VACUUM_PUMP_1_CMD_3V3  (via drill 0.5)
  Top 0.254: IC2.30 38.67,29.27 37.85,30.1 37.85,31.75 v38.35,32.26 | v48.13,35.94 53.59,35.94 v58.17,40.51 | v61.34,44.83 64.39,47.88 64.39,56.9 v66.04,58.55
  Bottom 0.254: v38.35,32.26 44.45,32.26 v48.13,35.94 | v58.17,40.51 61.34,43.69 v61.34,44.83 | v66.04,58.55 66.33,58.84 R30.2 68.58,58.61 T2.1
VACUUM_PUMP_1_VOLTAGE_MONITOR_0-1V  (via drill 0.5)
  Top 0.254: IC2.2 27.14,23.33 26.92,23.11 22.73,23.11 22.48,23.37 18.29,23.37 15.37,26.29 11.94,26.29 7.87,30.35 7.87,59.05 6.99,59.94 6.99,64.01 15.37,72.39 89.41,72.39 90.42,71.37 90.42,69.98 87.38,66.93 82.55,66.93 v81.66,66.04
  Bottom 0.254: R29.1 78.93,60.83 R28.2 79.63,61.54 C45.1 80.01,64.27 80.01,64.77 81.28,66.04 v81.66,66.04

### Text on the board
tPlace: meca 2014 / Rob'otter